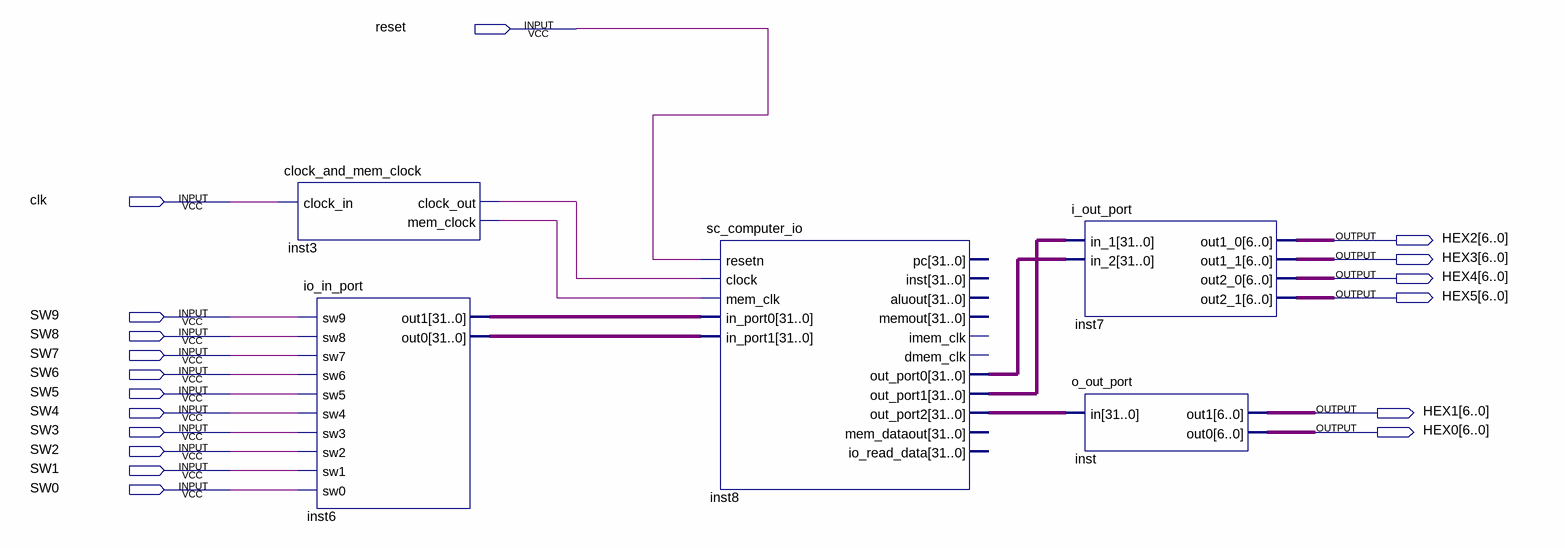
[diagram p0: schematic sheet]
// Quartus schematic IO.bdf as structural Verilog: 5 symbols, 18 pins
module IO (
  input  reset,
  input  clk,
  input  SW9,
  input  SW8,
  input  SW7,
  input  SW6,
  input  SW5,
  input  SW4,
  input  SW3,
  input  SW2,
  input  SW1,
  input  SW0,
  output [6:0] HEX2,
  output [6:0] HEX3,
  output [6:0] HEX4,
  output [6:0] HEX5,
  output [6:0] HEX1,
  output [6:0] HEX0
);

  wire inst3_clock_out, inst3_mem_clock;
  wire [31:0] inst6_out0, inst6_out1, inst8_out_port0, inst8_out_port1, inst8_out_port2;

  clock_and_mem_clock inst3 (.clock_in(clk), .clock_out(inst3_clock_out), .mem_clock(inst3_mem_clock));
  io_in_port inst6 (
    .sw9(SW9), .sw8(SW8), .sw7(SW7), .sw6(SW6), .sw5(SW5), .sw4(SW4), .sw3(SW3), .sw2(SW2), .sw1(SW1),
    .sw0(SW0), .out1(inst6_out1), .out0(inst6_out0));
  sc_computer_io inst8 (
    .resetn(reset), .clock(inst3_clock_out), .mem_clk(inst3_mem_clock), .in_port0(inst6_out1),
    .in_port1(inst6_out0), .out_port0(inst8_out_port0), .out_port1(inst8_out_port1),
    .out_port2(inst8_out_port2));  // open: pc, inst, aluout, memout, imem_clk, dmem_clk, mem_dataout, io_read_data
  i_out_port inst7 (
    .in_1(inst8_out_port1), .in_2(inst8_out_port0), .out1_0(HEX2), .out1_1(HEX3), .out2_0(HEX4), .out2_1(HEX5));
  o_out_port inst (.in(inst8_out_port2), .out1(HEX1), .out0(HEX0));
endmodule
